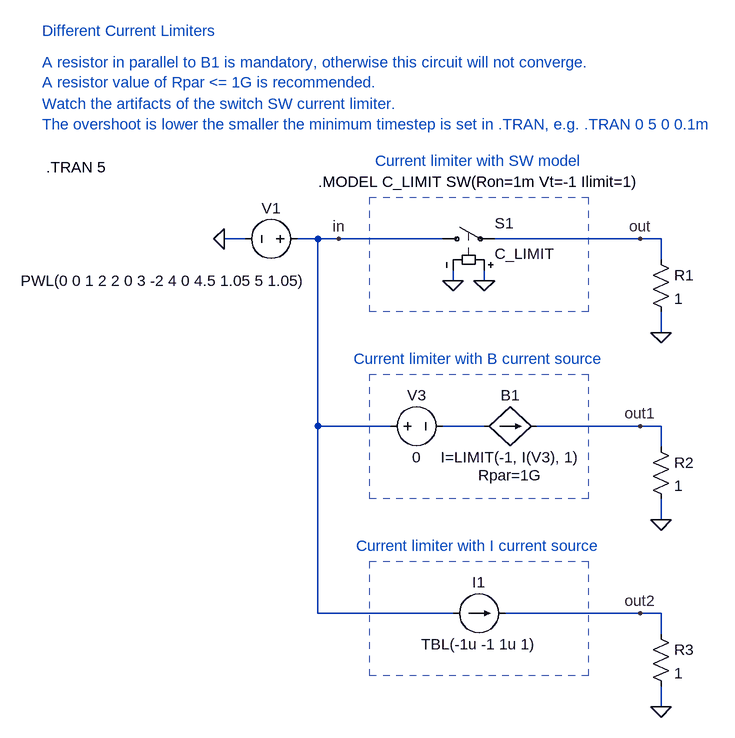
[diagram p0: schematic Current_limit2.asc]
Current_limit2.asc, the LTspice schematic file:
Version 4
SHEET 1 1132 1092
WIRE 16 96 16 112
WIRE -32 96 -32 112
WIRE 32 48 256 48
WIRE 288 48 288 80
WIRE 288 160 288 192
WIRE -272 48 -240 48
WIRE -208 48 -240 48
WIRE -352 48 -384 48
WIRE 96 336 256 336
WIRE 288 336 288 368
WIRE 288 448 288 480
WIRE 16 336 -48 336
WIRE -240 48 -240 336
WIRE -240 336 -128 336
WIRE -208 48 -48 48
WIRE 48 624 256 624
WIRE 288 624 288 656
WIRE 288 736 288 768
WIRE -32 624 -240 624
WIRE -240 624 -240 336
WIRE 256 48 288 48
WIRE 256 336 288 336
WIRE 256 624 288 624
FLAG -32 112 0
FLAG 288 192 0
FLAG 16 112 0
FLAG -384 48 0
FLAG -208 48 in
FLAG 256 48 out
FLAG 288 480 0
FLAG 256 336 out1
FLAG 288 768 0
FLAG 256 624 out2
SYMBOL sw -64 48 R270
WINDOW 0 24 96 VRight 0
WINDOW 3 -23 96 VRight 0
SYMATTR InstName S1
SYMATTR Value C_LIMIT
SYMBOL voltage -256 48 M270
WINDOW 123 -32 56 VBottom 0
WINDOW 39 -32 56 VBottom 0
WINDOW 0 32 56 VTop 0
WINDOW 3 -64 0 VRight 0
SYMATTR InstName V1
SYMATTR Value PWL(0 0 1 2 2 0 3 -2 4 0 4.5 1.05 5 1.05)
SYMBOL res 272 64 R0
SYMATTR InstName R1
SYMATTR Value 1
SYMBOL voltage -144 336 R270
WINDOW 0 32 56 VTop 0
WINDOW 3 -32 56 VBottom 0
SYMATTR InstName V3
SYMATTR Value 0
SYMBOL res 272 352 R0
SYMATTR InstName R2
SYMATTR Value 1
SYMBOL bi 16 336 R270
WINDOW 0 32 40 VTop 0
WINDOW 3 -32 40 VBottom 0
WINDOW 123 -60 40 VBottom 0
SYMATTR InstName B1
SYMATTR Value I=LIMIT(-1, I(V3), 1)
SYMATTR Value2 Rpar=1G
SYMBOL current -32 624 R270
WINDOW 0 32 40 VTop 0
WINDOW 3 -32 40 VBottom 0
WINDOW 123 -32 40 VBottom 0
WINDOW 39 -32 40 VBottom 0
SYMATTR InstName I1
SYMATTR Value TBL(-1u -1 1u 1)
SYMBOL res 272 640 R0
SYMATTR InstName R3
SYMATTR Value 1
TEXT 8 -40 Center 0 !.MODEL C_LIMIT SW(Ron=1m Vt=-1 Ilimit=1)
TEXT -658 -62 Left 0 !.TRAN 5
TEXT 8 -72 Center 0 ;Current limiter with SW model
TEXT 8 232 Center 0 ;Current limiter with B current source
TEXT -664 -272 Left 0 ;Different Current Limiters
TEXT -664 -160 Left 0 ;Watch the artifacts of the switch SW current limiter. \nThe overshoot is lower the smaller the minimum timestep is set in .TRAN, e.g. .TRAN 0 5 0 0.1m
TEXT -664 -224 Left 0 ;A resistor in parallel to B1 is mandatory, otherwise this circuit will not converge.\nA resistor value of Rpar <= 1G is recommended.
TEXT 8 520 Center 0 ;Current limiter with I current source
RECTANGLE Normal 176 448 -160 256 2
RECTANGLE Normal 176 160 -160 -16 2
RECTANGLE Normal 176 720 -160 544 2

The netlist it stands for:
* Current_limit2.asc
S1 in out 0 0 C_LIMIT
V1 in 0 PWL(0 0 1 2 2 0 3 -2 4 0 4.5 1.05 5 1.05)
R1 out 0 1
V3 in N001 0
R2 out1 0 1
B1 N001 out1 I=LIMIT(-1, I(V3), 1) Rpar=1G
I1 in out2 TBL(-1u -1 1u 1)
R3 out2 0 1
.MODEL C_LIMIT SW(Ron=1m Vt=-1 Ilimit=1)
.TRAN 5
* Current limiter with SW model
* Current limiter with B current source
* Different Current Limiters
* Watch the artifacts of the switch SW current limiter.
* The overshoot is lower the smaller the minimum timestep is set in .TRAN, e.g. .TRAN 0 5 0 0.1m
* A resistor in parallel to B1 is mandatory, otherwise this circuit will not converge.
* A resistor value of Rpar <= 1G is recommended.
* Current limiter with I current source
.backanno
.end